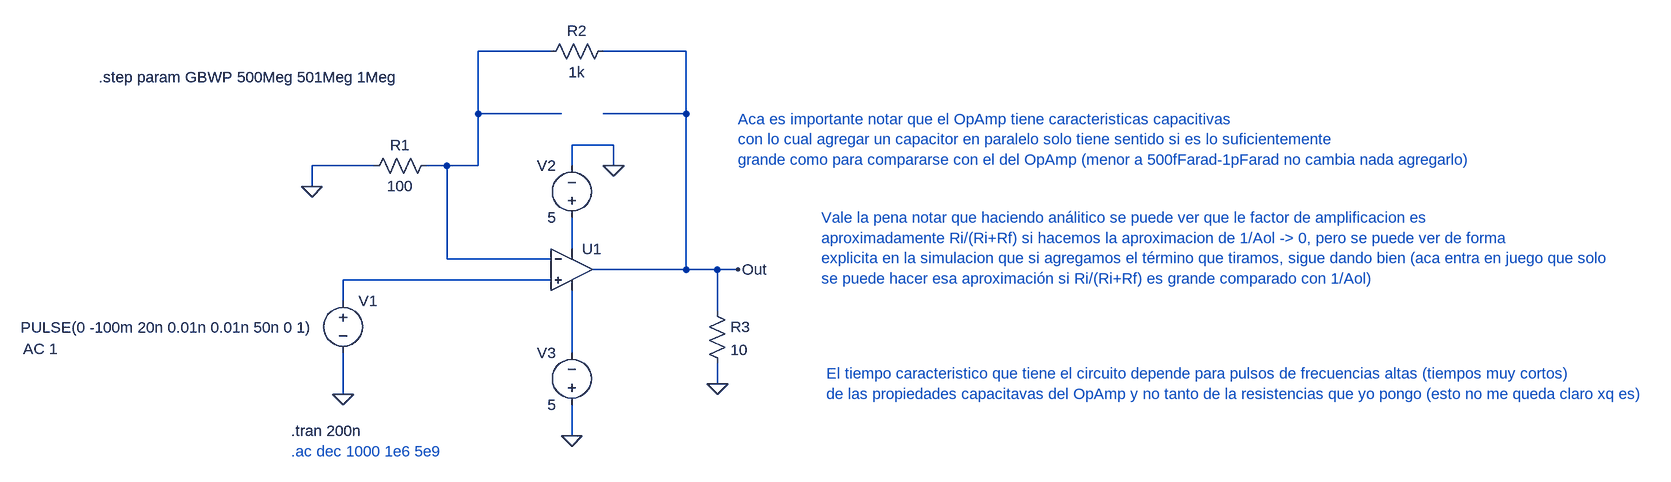
[diagram p0: schematic non_inverter_variable(con comentarios).asc]
non_inverter_variable(con comentarios).asc, the LTspice schematic file:
Version 4
SHEET 1 2060 680
WIRE 272 -112 160 -112
WIRE 480 -112 352 -112
WIRE 160 -16 160 -112
WIRE 288 -16 160 -16
WIRE 480 -16 480 -112
WIRE 480 -16 352 -16
WIRE 368 32 304 32
WIRE 0 64 -96 64
WIRE 112 64 80 64
WIRE 160 64 160 -16
WIRE 160 64 112 64
WIRE 304 64 304 32
WIRE 368 64 368 32
WIRE -96 96 -96 64
WIRE 304 192 304 144
WIRE 112 208 112 64
WIRE 272 208 112 208
WIRE 480 224 480 -16
WIRE 480 224 336 224
WIRE 528 224 480 224
WIRE 560 224 528 224
WIRE 272 240 -48 240
WIRE -48 272 -48 240
WIRE 528 288 528 224
WIRE 304 352 304 256
WIRE 528 400 528 368
WIRE -48 416 -48 352
WIRE 304 480 304 432
FLAG 304 480 0
FLAG 368 64 0
FLAG -48 416 0
FLAG -96 96 0
FLAG 560 224 Out
FLAG 528 400 0
SYMBOL voltage -48 256 R0
WINDOW 123 -492 90 Left 2
WINDOW 39 0 0 Left 0
WINDOW 3 -496 57 Left 2
SYMATTR Value2 AC 1
SYMATTR InstName V1
SYMATTR Value PULSE(0 -100m 20n 0.01n 0.01n 50n 0 1)
SYMBOL res 96 48 R90
WINDOW 0 0 56 VBottom 2
WINDOW 3 32 56 VTop 2
SYMATTR InstName R1
SYMATTR Value 100
SYMBOL res 368 -128 R90
WINDOW 0 0 56 VBottom 2
WINDOW 3 32 56 VTop 2
SYMATTR InstName R2
SYMATTR Value 1k
SYMBOL voltage 304 160 R180
WINDOW 0 24 96 Left 2
WINDOW 3 24 16 Left 2
WINDOW 123 0 0 Left 0
WINDOW 39 0 0 Left 0
SYMATTR InstName V2
SYMATTR Value 5
SYMBOL voltage 304 448 R180
WINDOW 0 24 96 Left 2
WINDOW 3 24 16 Left 2
WINDOW 123 0 0 Left 0
WINDOW 39 0 0 Left 0
SYMATTR InstName V3
SYMATTR Value 5
SYMBOL res 512 272 R0
SYMATTR InstName R3
SYMATTR Value 10
SYMBOL OpAmps\\UniversalOpAmp 304 224 R0
SYMATTR InstName U1
SYMATTR Value2 Avol=1Meg GBW={GBWP} Vos=0
TEXT -128 504 Left 2 ;.ac dec 1000 1e6 5e9
TEXT -424 -72 Left 2 !.step param GBWP 500Meg 501Meg 1Meg
TEXT -128 472 Left 2 !.tran 200n
TEXT 560 -8 Left 2 ;Aca es importante notar que el OpAmp tiene caracteristicas capacitivas \ncon lo cual agregar un capacitor en paralelo solo tiene sentido si es lo suficientemente\ngrande como para compararse con el del OpAmp (menor a 500fFarad-1pFarad no cambia nada agregarlo)
TEXT 688 144 Left 2 ;Vale la pena notar que haciendo análitico se puede ver que le factor de amplificacion es\naproximadamente Ri/(Ri+Rf) si hacemos la aproximacion de 1/Aol -> 0, pero se puede ver de forma\nexplicita en la simulacion que si agregamos el término que tiramos, sigue dando bien (aca entra en juego que solo\nse puede hacer esa aproximación si Ri/(Ri+Rf) es grande comparado con 1/Aol)
TEXT 696 384 Left 2 ;El tiempo caracteristico que tiene el circuito depende para pulsos de frecuencias altas (tiempos muy cortos)\nde las propiedades capacitavas del OpAmp y no tanto de la resistencias que yo pongo (esto no me queda claro xq es)

The netlist it stands for:
* non_inverter_variable(con comentarios).asc
V1 N003 0 PULSE(0 -100m 20n 0.01n 0.01n 50n 0 1) AC 1
R1 N001 0 100
R2 Out N001 1k
V2 N002 0 5
V3 0 N004 5
R3 Out 0 10
XU1 N003 N001 N002 N004 Out level1 Avol=1Meg GBW={GBWP} Vos=0 En=0 Enk=0 In=0 Ink=0 Rin=500Meg  ; pins In+ In- V+ V- OUT
* .ac dec 1000 1e6 5e9
.step param GBWP 500Meg 501Meg 1Meg
.tran 200n
* Aca es importante notar que el OpAmp tiene caracteristicas capacitivas
* con lo cual agregar un capacitor en paralelo solo tiene sentido si es lo suficientemente
* grande como para compararse con el del OpAmp (menor a 500fFarad-1pFarad no cambia nada agregarlo)
* Vale la pena notar que haciendo análitico se puede ver que le factor de amplificacion es
* aproximadamente Ri/(Ri+Rf) si hacemos la aproximacion de 1/Aol -> 0, pero se puede ver de forma
* explicita en la simulacion que si agregamos el término que tiramos, sigue dando bien (aca entra en juego que solo
* se puede hacer esa aproximación si Ri/(Ri+Rf) es grande comparado con 1/Aol)
* El tiempo caracteristico que tiene el circuito depende para pulsos de frecuencias altas (tiempos muy cortos)
* de las propiedades capacitavas del OpAmp y no tanto de la resistencias que yo pongo (esto no me queda claro xq es)
.lib UniversalOpAmp1.lib
.backanno
.end